# EAGLE design LDR V2 (EAGLE 8.5.1)

## Sheet 1 of 4: Sensor Input
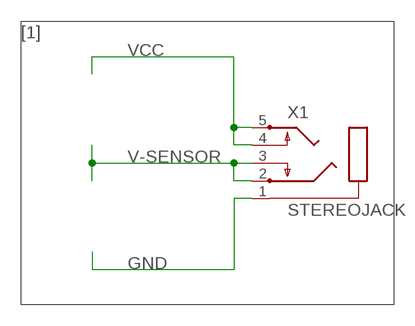
[diagram p0: schematic, sheet 1]

### Parts
X1  STEREOJACK  [STX3100]

### Nets
GND: X1.1 ; also sheet 2,3,4
V-SENSOR: X1.2 X1.3 ; also sheet 2
VCC: X1.4 X1.5 ; also sheet 2,3,4

### Notes on the sheet
- [1]

## Sheet 2 of 4: LP-Filter And Amplification
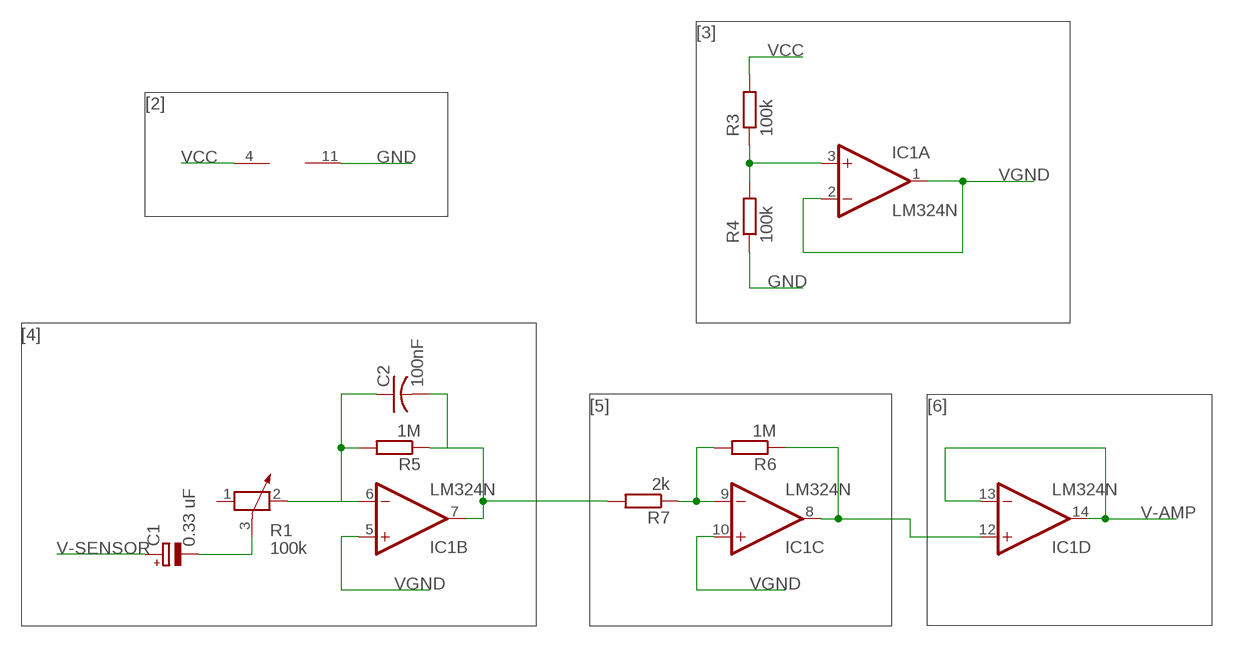
[diagram p1: schematic, sheet 2]

### Parts
C1  0.33 uF  CPOL-EUE1.8-4  [E1,8-4]
C2  100nF  C-US025-025X050  [C025-025X050]
IC1  LM324N  [DIL14]
R1  100k  POTENTIOMETER_PT-10  [PT-10]
R3  100k  R-EU_0207/7  [0207/7]
R4  100k  R-EU_0207/7  [0207/7]
R5  1M  R-EU_0207/7  [0207/7]
R6  1M  R-EU_0207/7  [0207/7]
R7  2k  R-EU_0207/7  [0207/7]

### Nets
GND: IC1.11(P:V-) R4.1 ; also sheet 1,3,4
N$1: C1.- R1.3
N$3: C2.1 IC1.6(B:-IN) R1.2 R5.2
N$4: IC1.3(A:+IN) R3.1 R4.2
N$5: C2.2 IC1.7(B:OUT) R5.1 R7.2
N$7: IC1.9(C:-IN) R6.2 R7.1
N$9: IC1.8(C:OUT) IC1.12(D:+IN) R6.1
V-AMP: IC1.13(D:-IN) IC1.14(D:OUT) ; also sheet 3
V-SENSOR: C1.+ ; also sheet 1
VCC: IC1.4(P:V+) R3.2 ; also sheet 1,3,4
VGND: IC1.1(A:OUT) IC1.2(A:-IN) IC1.5(B:+IN) IC1.10(C:+IN)
Unconnected: R1.1

### Notes on the sheet
- [3]
- [2]
- [4]
- [5] | [6]

## Sheet 3 of 4: Pulse Identfication and 50HZ Notching
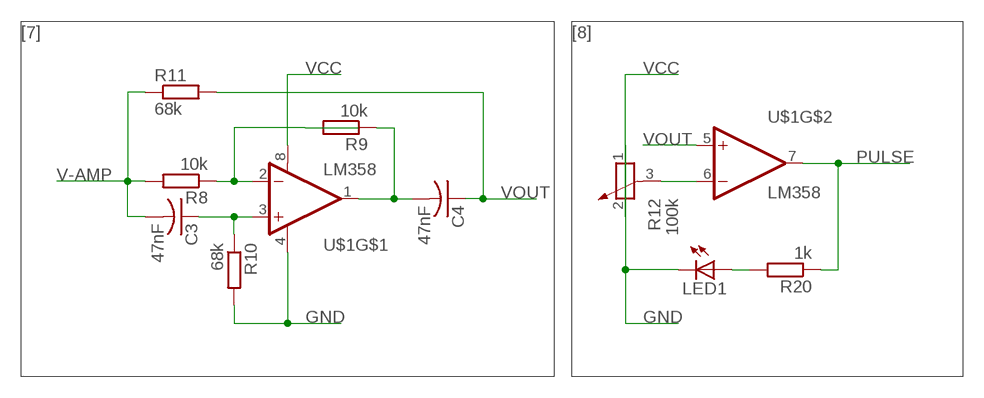
[diagram p2: schematic, sheet 3]

### Parts
C3  47nF  C-US025-025X050  [C025-025X050]
C4  47nF  C-US025-025X050  [C025-025X050]
LED1  LED5MM  [LED5MM]
R8  10k  R-EU_0207/7  [0207/7]
R9  10k  R-EU_0207/7  [0207/7]
R10  68k  R-EU_0207/7  [0207/7]
R11  68k  R-EU_0207/7  [0207/7]
R12  100k  POTENTIOMETER_PT-10  [PT-10]
R20  1k  R-EU_0207/7  [0207/7]
U$1  LM358  [DIP08]

### Nets
GND: LED1.K(C) R10.2 R12.1 U$1.4(V-) ; also sheet 1,2,4
N$2: R8.1 R9.2 U$1.2(-IN)
N$8: C3.1 R10.1 U$1.3(+IN)
N$10: R12.3 U$1.6(-IN)
N$17: C4.2 R9.1 U$1.1(OUT)
N$19: LED1.A R20.2
PULSE: R20.1 U$1.7(OUT) ; also sheet 4
V-AMP: C3.2 R8.2 R11.1 ; also sheet 2
VCC: R12.2 U$1.8(V+) ; also sheet 1,2,4
VOUT: C4.1 R11.2 U$1.5(+IN) ; also sheet 4

### Notes on the sheet
- [7] | [8]

## Sheet 4 of 4: Display Heart Rate on 4-digit 7-segment COM-Cathode
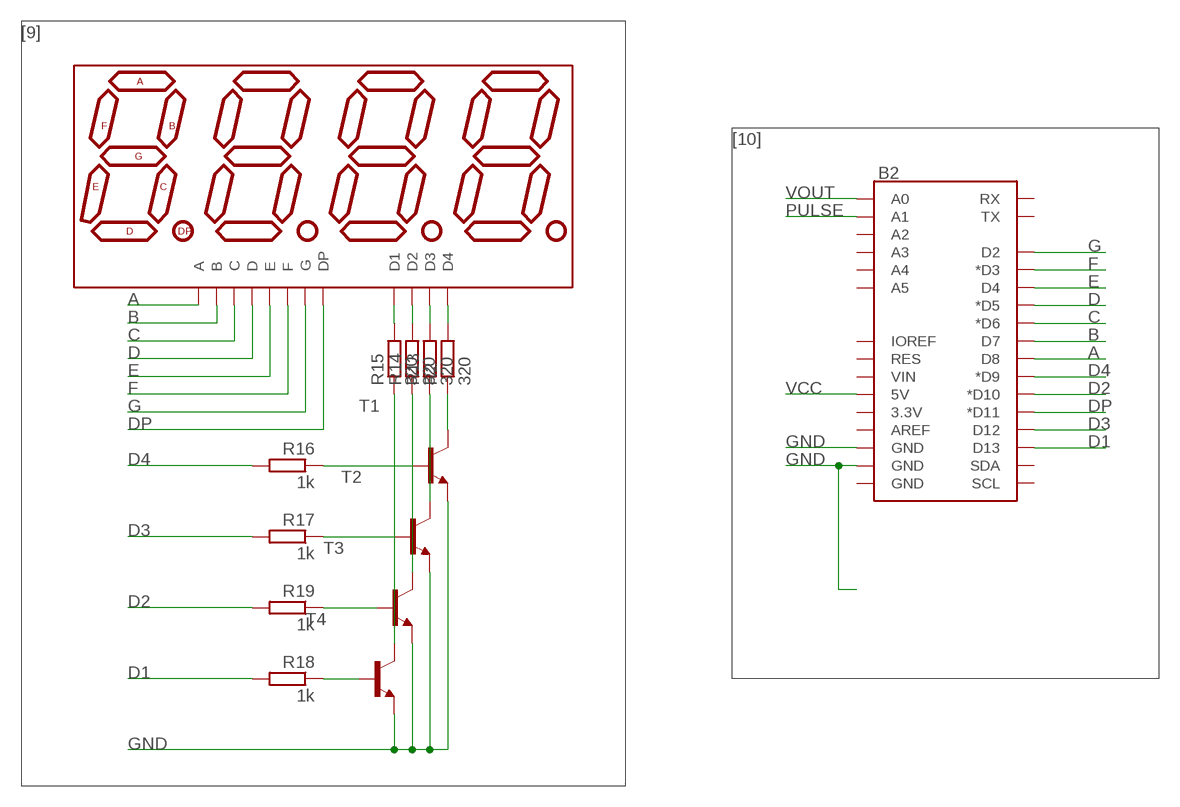
[diagram p3: schematic, sheet 4]

### Parts
B2  ARDUINO_UNO_R3_SHIELDUNO_R3_SHIELD_LOCK  [UNO_R3_SHIELD_LOCK]
DISP2  ATA8041AB  7-SEGMENT-4DIGIT-20MM-BLUE  [7-SEGMENT-4DIGIT-20MM]
R2  320  R-EU_0207/7  [0207/7]
R13  320  R-EU_0207/7  [0207/7]
R14  320  R-EU_0207/7  [0207/7]
R15  320  R-EU_0207/7  [0207/7]
R16  1k  R-EU_0207/7  [0207/7]
R17  1k  R-EU_0207/7  [0207/7]
R18  1k  R-EU_0207/7  [0207/7]
R19  1k  R-EU_0207/7  [0207/7]
T1  2N2222-NPN-TO92-EBC  [TO92-EBC]
T2  2N2222-NPN-TO92-EBC  [TO92-EBC]
T3  2N2222-NPN-TO92-EBC  [TO92-EBC]
T4  2N2222-NPN-TO92-EBC  [TO92-EBC]

### Nets
1: DISP2.12(D1) R15.2
2: DISP2.9(D2) R14.2
3: DISP2.8(D3) R13.2
4: DISP2.6(D4) R2.2
A: B2.D8 DISP2.11(A)
B: B2.D7 DISP2.7(B)
C: B2.D6(*D6) DISP2.4(C)
D: B2.D5(*D5) DISP2.2(D)
D1: B2.D13 R18.2
D2: B2.D10(*D10) R19.2
D3: B2.D12 R17.2
D4: B2.D9(*D9) R16.2
DP: B2.D11(*D11) DISP2.3(DP)
E: B2.D4 DISP2.1(E)
F: B2.D3(*D3) DISP2.10(F)
G: B2.D2 DISP2.5(G)
GND: B2.GND@1(GND) B2.GND@2(GND) T1.E T2.E T3.E T4.E ; also sheet 1,2,3
N$6: R2.1 T1.C
N$11: R18.1 T4.B
N$12: R19.1 T3.B
N$13: R17.1 T2.B
N$14: R16.1 T1.B
N$15: R13.1 T2.C
N$16: R14.1 T3.C
N$18: R15.1 T4.C
PULSE: B2.A1 ; also sheet 3
VCC: B2.5V ; also sheet 1,2,3
VOUT: B2.A0 ; also sheet 3
Unconnected: B2.3.3V B2.A2 B2.A3 B2.A4 B2.A5 B2.AREF B2.GND@0(GND) B2.IOREF B2.RES B2.RX B2.SCL B2.SDA B2.TX B2.VIN

### Notes on the sheet
- [9]
- [10]

## Library data of the parts
B2 = SparkFun-Boards:ARDUINO_UNO_R3_SHIELD: Arduino R3 Shield Footprint Shield form compatible with the Arduino Uno R3. SparkFun Products: MG2639 Cellular Shield <https://www.sparkfun.com/products/13120> MIDI Shield <https://www.sparkfun.com/products/12898> R3 Stackable Headers Kit <https://www.sparkfun.com/products/11417>
C1 = rcl:CPOL-EU: POLARIZED CAPACITOR, European symbol; SPICEPREFIX: C
C2-C4 = rcl:C-US: CAPACITOR, American symbol; SPICEPREFIX: C
DISP2 = SparkFun-LED:7-SEGMENT-4DIGIT-20MM: 4 Digit 7 Segment Display This is a part for the 4-Digit 7-segment LEDs from Young Sun. Different from the Digikey LEDs, all 16 pins are used. The LONGPADS Variant is used for a test jig, but you may like it because there is more pad to solder to. If you are concerned about routing space, the standard works just fine though. Datasheets: Red <http://cdn.sparkfun.com/datasheets/Components/LED/1LEDREDCC.pdf> Yellow <http://cdn.sparkfun.com/datasheets/Components/LED/1LEDYELCC.pdf> Green <http://cdn.sparkfun.com/datasheets/Components/LED/1LEDGRNCC.pdf> Blue <http://cdn.sparkfun.com/datasheets/Components/LED/1LEDBLUCC.pdf> White <http://cdn.sparkfun.com/datasheets/Components/LED/1LEDWHTCC.pdf> SparkFun Products Raw Components 7-Segment Display - 20mm (Red) <https://www.sparkfun.com/products/11405> (COM-11405) 7-Segment Display - 20mm (Yellow) <https://www.sparkfun.com/products/11406> (COM-11406) 7-Segment Display - 20mm (Green) <https://www.sparkfun.com/products/11407> (COM-11407) 7-Segment Display - 20mm (Blue) <https://www.sparkfun.com/products/11408> (COM-11408) 7-Segment Display - 20mm (White) <https://www.sparkfun.com/products/11409> (COM-11409) Serial Controlled SparkFun OpenSegment Serial Display - 20mm (Red) <https://www.sparkfun.com/products/11644> (COM-11644) SparkFun OpenSegment Serial Display - 20mm (Yellow) <https://www.sparkfun.com/products/11645> (COM-11645) SparkFun OpenSegment Serial Display - 20mm (Green) <https://www.sparkfun.com/products/11646> (COM-11646) SparkFun OpenSegment Serial Display - 20mm (Blue) <https://www.sparkfun.com/products/11647> (COM-11647) SparkFun OpenSegment Serial Display - 20mm (White) <https://www.sparkfun.com/products/11648> (COM-11648) Other SparkFun OpenSegment Shield <https://www.sparkfun.com/products/13190> (DEV-13190); PROD_ID: COMP-11446
IC1 = linear:LM324: OP AMP
LED1 = adafruit:LED: LED OSRAM: - CHIPLED LG R971, LG N971, LY N971, LG Q971, LY Q971, LO R971, LY R971 LH N974, LH R974 LS Q976, LO Q976, LY Q976 LO Q996 - Hyper CHIPLED LW Q18S LB Q993, LB Q99A, LB R99A - SideLED LS A670, LO A670, LY A670, LG A670, LP A670 LB A673, LV A673, LT A673, LW A673 LH A674 LY A675 LS A676, LA A676, LO A676, LY A676, LW A676 LS A679, LY A679, LG A679 - Hyper Micro SIDELED® LS Y876, LA Y876, LO Y876, LY Y876 LT Y87S - SmartLED LW L88C, LW L88S LB L89C, LB L89S, LG L890 LS L89K, LO L89K, LY L89K LS L896, LA L896, LO L896, LY L896 - TOPLED LS T670, LO T670, LY T670, LG T670, LP T670 LSG T670, LSP T670, LSY T670, LOP T670, LYG T670 LG T671, LOG T671, LSG T671 LB T673, LV T673, LT T673, LW T673 LH T674 LS T676, LA T676, LO T676, LY T676, LB T676, LH T676, LSB T676, LW T676 LB T67C, LV T67C, LT T67C, LS T67K, LO T67K, LY T67K, LW E67C LS E67B, LA E67B, LO E67B, LY E67B, LB E67C, LV E67C, LT E67C LW T67C LS T679, LY T679, LG T679 LS T770, LO T770, LY T770, LG T770, LP T770 LB T773, LV T773, LT T773, LW T773 LH T774 LS E675, LA E675, LY E675, LS T675 LS T776, LA T776, LO T776, LY T776, LB T776 LHGB T686 LT T68C, LB T68C - Hyper Mini TOPLED® LB M676 - Mini TOPLED Santana® LG M470 LS M47K, LO M47K, LY M47K Source: http://www.osram.convergy.de/
R1 R12 = rcl:POTENTIOMETER_: Potentiometer; SPICEMODEL: POT; SPICEPREFIX: X
R2-R11 R13-R20 = rcl:R-EU_: RESISTOR, European symbol; SPICEPREFIX: R
T1-T4 = transistor-neu-to92:*-NPN-: NPN Transistror
U$1 = SparkFun:LM358
X1 = adafruit:STEREOJACK: MIC/HEADPHONE JACK Stereo jack with two switches. Kycon STX3100, CUI SJ1-3555NG and/or 4UCon 05544

## Board
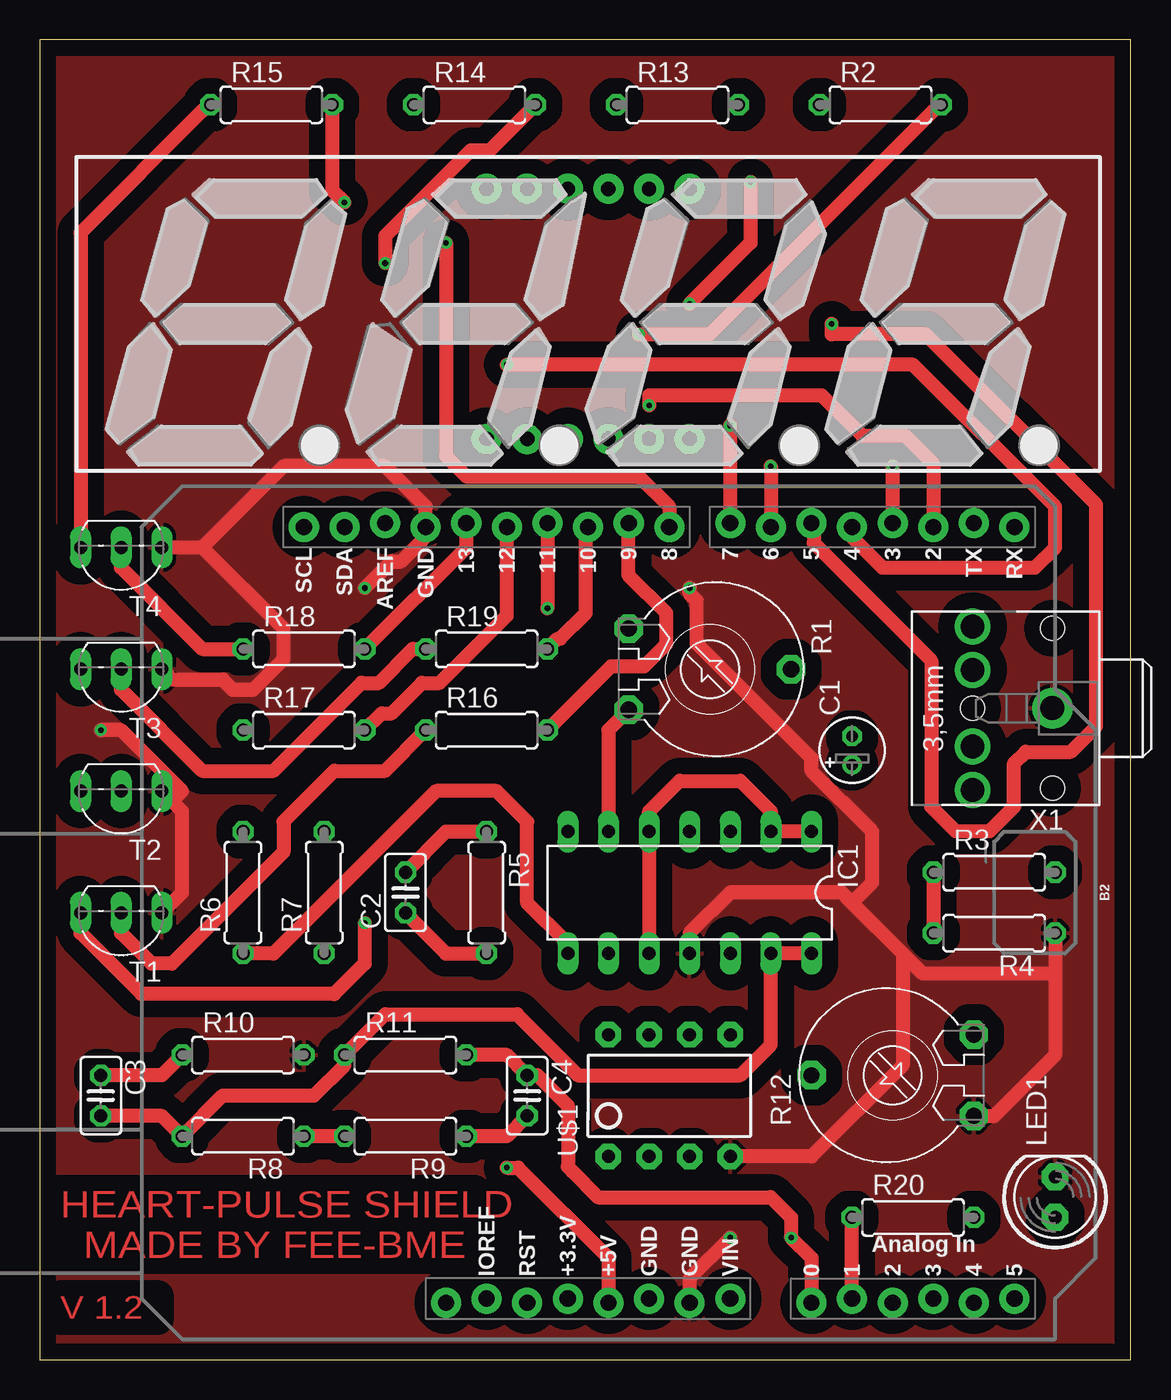
[diagram p4: board, top side]
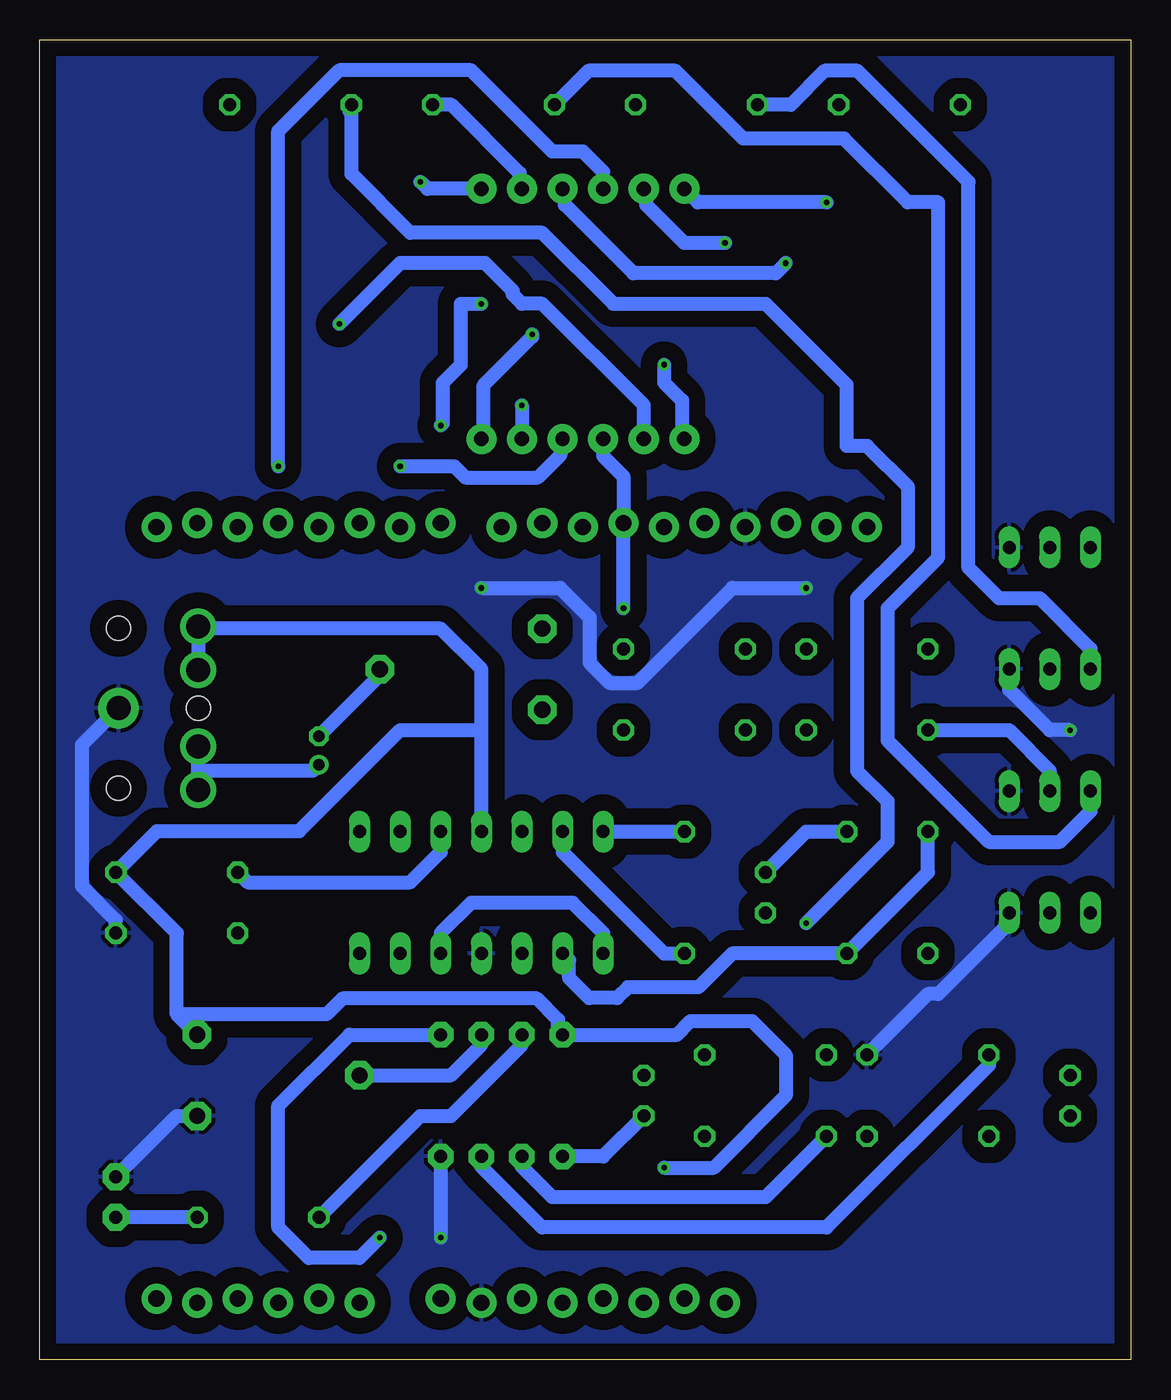
[diagram p5: board, bottom side, seen from below]

Size 68.25 x 82.54 mm. Coordinates in mm from the lower left corner, seen from the top.
Outline: 0,0 68.25,0 68.25,82.54 0,82.54 0,0
Copper layers (1*16): Top 0.035mm / dielectric 1.5mm / Bottom 0.035mm
Design rules "default *": minimum track width 35mil, minimum drill 0.35mm, track to track 40mil, track to pad 40mil, pad to pad 6mil, via to via 6mil, smd to smd 6mil, copper to edge 40mil, drill to drill 6mil, minimum pad ring 10mil, minimum via ring 8mil, stop-mask expansion 4mil, vias tented up to drill 0mil, thermal gap 10mil

### Footprints (pad centres in the part's own frame; a part is rotated, then mirrored left to right if it is on the bottom)
UNO_R3_SHIELD_LOCK = drill 1.016 pad 1.88: 3.3V 24.13,-3.81; 5V 24.384,-1.27; A0 24.384,11.43; A1 24.13,13.97; A2 24.384,16.51; A3 24.13,19.05; A4 24.384,21.59; A5 24.13,24.13; AREF -24.384,-15.24; D2 -24.13,19.05; D3 -24.384,16.51; D4 -24.13,13.97; D5 -24.384,11.43; D6 -24.13,8.89; D7 -24.384,6.35; D8 -24.13,2.54; D9 -24.384,0; D10 -24.13,-2.54; D11 -24.384,-5.08; D12 -24.13,-7.62; D13 -24.384,-10.16; GND@0 24.13,1.27; GND@1 24.384,3.81; GND@2 -24.13,-12.7; IOREF 24.13,-8.89; NC 24.384,-11.43; RES 24.384,-6.35; RX -24.13,24.13; SCL -24.13,-20.32; SDA -24.13,-17.78; TX -24.384,21.59; VIN 24.13,6.35
E1,8-4 = drill 0.711 pad 1.168: + -0.889,0 | drill 0.711 pad 1.168 octagon: - 0.889,0
C025-025X050 = drill 0.813 octagon: 1 -1.27,0; 2 1.27,0
7-SEGMENT-4DIGIT-20MM = drill 0.9 pad 1.88: 1 -6.35,-10.998; 2 -3.81,-10.998; 3 -1.27,-10.998; 4 1.27,-10.998; 5 3.81,-10.998; 6 6.35,-10.998; 7 6.35,4.648; 8 3.81,4.648; 9 1.27,4.648; 10 -1.27,4.648; 11 -3.81,4.648; 12 -6.35,4.648
DIL14 = drill 0.813 long: 1 -7.62,-3.81; 2 -5.08,-3.81; 3 -2.54,-3.81; 4 0,-3.81; 5 2.54,-3.81; 6 5.08,-3.81; 7 7.62,-3.81; 8 7.62,3.81; 9 5.08,3.81; 10 2.54,3.81; 11 0,3.81; 12 -2.54,3.81; 13 -5.08,3.81; 14 -7.62,3.81
LED5MM = drill 0.813 pad 1.676 octagon: A -1.27,0; K 1.27,0
PT-10 = drill 1.016 pad 1.778 octagon: 1 -2.54,-5.08; 2 2.54,-5.08; 3 0,5.08
0207/7 = drill 0.813 octagon: 1 -3.81,0; 2 3.81,0
TO92-EBC = drill 0.813 long: B 0,-1.27; C 2.54,-1.27; E -2.54,-1.27
DIP08 = drill 0.813 pad 1.6 octagon: 1 -3.81,-3.81; 2 -1.27,-3.81; 3 1.27,-3.81; 4 3.81,-3.81; 5 3.81,3.81; 6 1.27,3.81; 7 -1.27,3.81; 8 -3.81,3.81
STX3100 = drill 1.5 pad 2.54: 1 2.7,-0.1 | drill 1.5: 2 7.7,5; 3 7.7,2.3; 4 7.7,-2.5; 5 7.7,-5.2 | hole 1.5: 2.7,4.9; 2.7,-5.1; 7.7,-0.1

### Placement (x,y rotation side)
B2  36.83,27.94 270 top
C1  50.8,38.1 90 top
C2  22.86,29.21 90 top
C3  3.81,16.51 270 top
C4  30.48,16.51 270 top
DISP2  34.29,68.58 0 top
IC1  40.64,29.21 180 top
LED1  63.5,10.16 90 top
R1  41.91,43.18 270 top
R2  52.58,78.49 0 top
R3  59.69,30.48 0 top
R4  59.69,26.67 180 top
R5  27.94,29.21 270 top
R6  12.7,29.21 90 top
R7  17.78,29.21 90 top
R8  12.7,13.97 180 top
R9  22.86,13.97 180 top
R10  12.7,19.05 0 top
R11  22.86,19.05 0 top
R12  53.34,17.78 90 top
R13  39.88,78.49 0 top
R14  27.18,78.49 0 top
R15  14.48,78.49 0 top
R16  27.94,39.37 0 top
R17  16.51,39.37 0 top
R18  16.51,44.45 0 top
R19  27.94,44.45 0 top
R20  54.61,8.89 0 top
T1  5.08,26.67 180 top
T2  5.08,34.29 180 top
T3  5.08,41.91 180 top
T4  5.08,49.53 180 top
U$1  39.37,16.51 0 top
X1  66.04,40.64 180 top

### Tracks (layer width: path | path; a pad name or v marks a point on that pad's centre or on a via)
1  (via drill 0.35)
  Top 0.889: R15.2 18.29,73.15 v19.05,72.39
  Bottom 0.889: v19.05,72.39 27.1,72.39 DISP2.12
2  (via drill 0.35)
  Top 0.889: R14.2 28.13,75.63 26.95,75.63 21.59,70.27 v21.59,68.58
  Bottom 0.889: DISP2.9 35.42,73.09 35.42,72.23 31.13,67.94 22.23,67.94 v21.59,68.58
3
  Bottom 0.889: DISP2.8 38.24,73.37 38.24,74.22 42.5,78.49 R13.2
4  (via drill 0.35)
  Top 0.889: v37.47,64.14 41.91,64.14 55.88,78.11 R2.2
  Bottom 0.889: DISP2.6 40.5,57.72 40.5,60.95 37.47,63.98 v37.47,64.14
A  (via drill 0.35)
  Top 0.889: B2.D8 39.37,53.34 37.47,55.24 26.67,55.24 25.4,56.52 v25.4,69.85
  Bottom 0.889: DISP2.11 30.34,73.09 30.34,72.23 27.96,69.85 v25.4,69.85
B  (via drill 0.35)
  Top 0.889: B2.D7 v43.18,58.42 | v44.45,73.66 44.45,69.85 v40.64,66.04
  Bottom 0.889: DISP2.7 44.02,73.23 v44.45,73.66 | v40.64,66.04 41.91,66.04 41.91,62.23 43.04,61.1 43.04,58.56 v43.18,58.42
C  (via drill 0.35)
  Top 0.889: v45.72,55.88 B2.D6
  Bottom 0.889: v45.72,55.88 42.33,55.88 41.63,55.18 37.11,55.18 35.7,56.59 35.7,57.44 DISP2.4
D  (via drill 0.35)
  Top 0.889: B2.D5 48.4,52.18 48.4,51.08 55.76,43.72 55.76,34.57 57.27,33.05 59.41,33.05 60.92,34.57 60.92,37.27 61.67,38.01 64.47,38.01 66.07,39.61 66.07,53.46 55.4,64.14 49.53,64.14 v49.53,64.77
  Bottom 0.889: DISP2.2 30.48,59.69 36.83,66.04 38.1,66.04 38.69,66.63 38.69,66.85 40.42,68.58 45.72,68.58 v49.53,64.77
D1
  Top 0.889: R18.2 26.67,50.8 B2.D13
D2
  Top 0.889: B2.D10 34.15,51.93 34.15,46.7 32.54,45.09 32.38,45.09 R19.2
D3
  Top 0.889: B2.D12 29.21,46.53 25.01,42.33 23.89,42.33 21.99,40.42 21.37,40.42 R17.2
D4
  Top 0.889: B2.D9 36.83,49.04 39.18,46.69 39.18,44.75 37.8,43.37 35.75,43.37 R16.2
DP  (via drill 0.35)
  Top 0.889: B2.D11 v31.75,46.99
  Bottom 0.889: DISP2.3 33.02,56.52 31.75,55.24 B2.D11 v31.75,46.99
E  (via drill 0.35)
  Top 0.889: B2.D4 50.8,51.44 52.7,49.53 62.23,49.53 63.5,50.8 63.5,53.34 54.61,62.23 v29.21,62.23
  Bottom 0.889: v29.21,62.23 29.21,61.11 28.08,59.98 28.08,57.72 DISP2.1
F  (via drill 0.35)
  Top 0.889: B2.D3 v53.34,55.88
  Bottom 0.889: DISP2.10 33.02,74.3 34.29,75.56 36.2,75.56 41.27,80.64 49.53,80.64 53.34,76.83 v53.34,55.88
G  (via drill 0.35)
  Top 0.889: v38.1,59.69 38.1,60.33 48.9,60.33 51.44,57.78 54.13,57.78 55.88,56.03 55.88,53.34 B2.D2
  Bottom 0.889: v38.1,59.69 DISP2.5
GND  (via drill 0.35)
  Top 0.889: 10.16,50.8 T4.E | 10.16,50.8 15.24,55.88 21.59,55.88 24.13,53.34 B2.GND@2 23.99,51.93 23.99,51.33 22.58,49.92 21.98,49.92 v20.32,48.26 | 8.26,34.92 8.89,34.29 8.89,29.21 T1.E | v3.81,39.37 5.08,39.37 8.89,35.56 8.26,34.92 | 8.26,34.92 T2.E | 10.16,50.8 15.24,45.72 15.24,43.81 13.34,41.91 12.06,41.91 11.43,42.55 8.26,42.55 T3.E | R12.1 59.69,15.24 63.5,19.05 63.5,24.13 | R4.1 63.5,24.13 | IC1.11 40.64,26.67 43.18,29.21 50.16,29.21 50.8,28.57 | 53.98,25.4 55.24,24.13 63.5,24.13 | 53.98,25.4 50.8,28.57 | U$1.4 48.26,12.7 53.98,18.41 53.98,25.4 | 50.8,28.57 52.07,29.84 52.07,33.02 48.26,36.83 48.26,37.61 41.08,44.79 41.08,47.48 40.64,47.93 v40.64,48.26 | v43.18,7.62 40.64,5.08 B2.GND@1
  Bottom 0.889: R10.2 12.7,22.86 12.06,22.86 7.62,27.3 T1.E | T3.E 7.62,41.91 5.08,39.37 v3.81,39.37 | LED1.K 59.69,15.24 R12.1 | R4.1 63.5,27.48 65.62,29.6 65.62,38.46 X1.1 | 24.27,51.93 B2.GND@2 | v40.64,48.26 35.71,48.26 33.87,46.42 33.87,43.57 32.63,42.33 30.87,42.33 24.94,48.26 v20.32,48.26 | U$1.4 v43.18,7.62
  pour Top: 0,82.55 68.58,82.55 68.58,0 0,0
  pour Bottom: 0,82.55 67.31,82.55 68.58,81.28 68.58,0 0,0
N$1
  Bottom 0.889: C1.- 46.99,42.8 R1.3
N$2
  Top 0.889: R9.2 R8.1
  Bottom 0.889: U$1.2 38.1,12.06 36.2,10.16 22.86,10.16 R9.2
N$3
  Top 0.889: R5.2 25.4,25.4 C2.1 | IC1.6 35.56,39.37 R1.2
  Bottom 0.889: R5.2 29.21,25.4 35.56,31.75 IC1.6
N$4
  Top 0.889: R3.1 R4.2
  Bottom 0.889: IC1.3 43.18,31.75 45.09,29.84 55.24,29.84 R3.1
N$5
  Top 0.889: R5.1 25.4,33.02 C2.2
  Bottom 0.889: IC1.7 R5.1 | R7.2 20.32,33.02 C2.2
N$6  (via drill 0.35)
  Top 0.889: T1.C 2.54,26.67 6.35,22.86 18.41,22.86 20.32,24.77 v20.32,27.3
  Bottom 0.889: v20.32,27.3 15.24,32.38 15.24,34.92 17.14,36.83 17.14,47.62 13.97,50.8 13.97,54.61 16.51,57.15 17.78,57.15 17.78,60.96 22.86,66.04 32.38,66.04 36.83,70.48 45.09,70.48 48.77,74.17 R2.1 48.9,78.11
N$7
  Bottom 0.889: R6.2 12.7,30.48 R7.1 24.94,25.4 27.06,23.28 31.48,23.28 32.14,22.62 33.9,22.62 35.14,23.86 35.14,24.98 IC1.9
N$8
  Top 0.889: C3.1 7.62,17.78 R10.1
  Bottom 0.889: U$1.3 40.64,12.06 36.83,8.26 19.05,8.26 8.89,18.41 R10.1
N$9
  Top 0.889: R6.1 14.61,25.4 24.77,35.56 28.57,35.56 30.48,33.66 30.48,28.57 33.02,26.04 IC1.8
  Bottom 0.889: IC1.12 43.18,26.67 41.27,28.57 34.92,28.57 33.02,26.67 IC1.8
N$10
  Bottom 0.889: U$1.6 40.64,19.68 42.55,17.78 R12.3
N$11
  Top 0.889: R18.1 10.16,44.45 5.08,49.53 T4.B
N$12
  Top 0.889: T3.B 5.08,41.91 10.16,36.83 14.61,36.83 20.1,42.33 21.2,42.33 23.32,44.45 R19.1
N$13
  Bottom 0.889: T2.B 5.08,36.83 7.62,39.37 R17.1
N$14
  Top 0.889: T1.B 5.08,26.67 6.99,24.77 8.26,24.77 15.24,31.75 15.24,33.66 18.41,36.83 21.59,36.83 R16.1
N$15
  Bottom 0.889: T2.C 2.54,34.29 4.45,32.38 8.89,32.38 15.24,38.73 15.24,46.99 12.06,50.16 12.06,72.39 13.97,72.39 17.95,76.36 24.25,76.36 28.49,80.61 33.95,80.61 R13.1
N$16
  Bottom 0.889: T3.C 2.54,44.45 5.71,47.62 8.26,47.62 10.16,49.53 10.16,73.66 17.11,80.61 19.17,80.61 21.29,78.49 R14.1
N$17
  Top 0.889: R9.1 29.21,13.97 C4.2
  Bottom 0.889: U$1.1 33.02,12.7 C4.2
N$18
  Top 0.889: T4.C 2.54,70.48 10.16,78.11 R15.1
N$19
  Bottom 0.889: R20.2 LED1.A
PULSE
  Top 0.889: B2.A1 R20.1
  Bottom 0.889: U$1.7 38.1,19.68 42.55,15.24 44.45,15.24 R20.1
V-AMP
  Top 0.889: IC1.14 IC1.13 45.72,19.68 43.81,17.78 33.66,17.78 29.84,21.59 21.59,21.59 R11.1 19.05,18.41 17.14,16.51 11.43,16.51 R8.2 7.62,15.24 C3.2
V-SENSOR
  Bottom 0.889: X1.2 58.34,36.83 | 58.34,36.83 X1.3 | C1.+ 51.18,36.83 58.34,36.83
VCC  (via drill 0.35)
  Top 0.889: v29.21,12 29.91,12 35.56,6.35 B2.5V
  Bottom 0.889: 59.69,21.59 59.69,26.67 R3.2 60.92,33.05 52.03,33.05 45.71,39.37 40.64,39.37 | R12.2 59.69,21.59 | X1.4 X1.5 58.22,45.72 43.18,45.72 40.64,43.18 40.64,39.37 | IC1.4 40.64,39.37 | 59.69,21.59 50.32,21.59 49.33,22.58 37.16,22.58 35.84,21.26 35.84,20.6 U$1.8 28.4,20.32 27.55,21.17 23.71,21.17 21.59,19.05 21.59,16.51 26.1,12 v29.21,12
VGND
  Top 0.889: IC1.1 IC1.2 45.72,34.29 43.81,36.2 40.01,36.2 38.1,34.29 IC1.5 IC1.10
VOUT  (via drill 0.35)
  Top 0.889: R11.2 29.21,19.05 C4.1 31.11,17.78 33.02,15.88 33.02,12.06 33.3,11.79 33.3,11.76 34.9,10.16 45.72,10.16 46.99,8.89 v46.99,7.62 48.26,6.35 B2.A0 48.26,3.81
  Bottom 0.889: U$1.5 48.9,20.32 53.34,15.88 53.34,8.26 51.44,6.35 48.26,6.35 v46.99,7.62

### Text on the board
Top: HEART-PULSE SHIELD / MADE BY FEE-BME | V 1.2